# EasyEDA Pro project ProPrj_四串锂电池电源_2025-05-06.epro, board PCB2
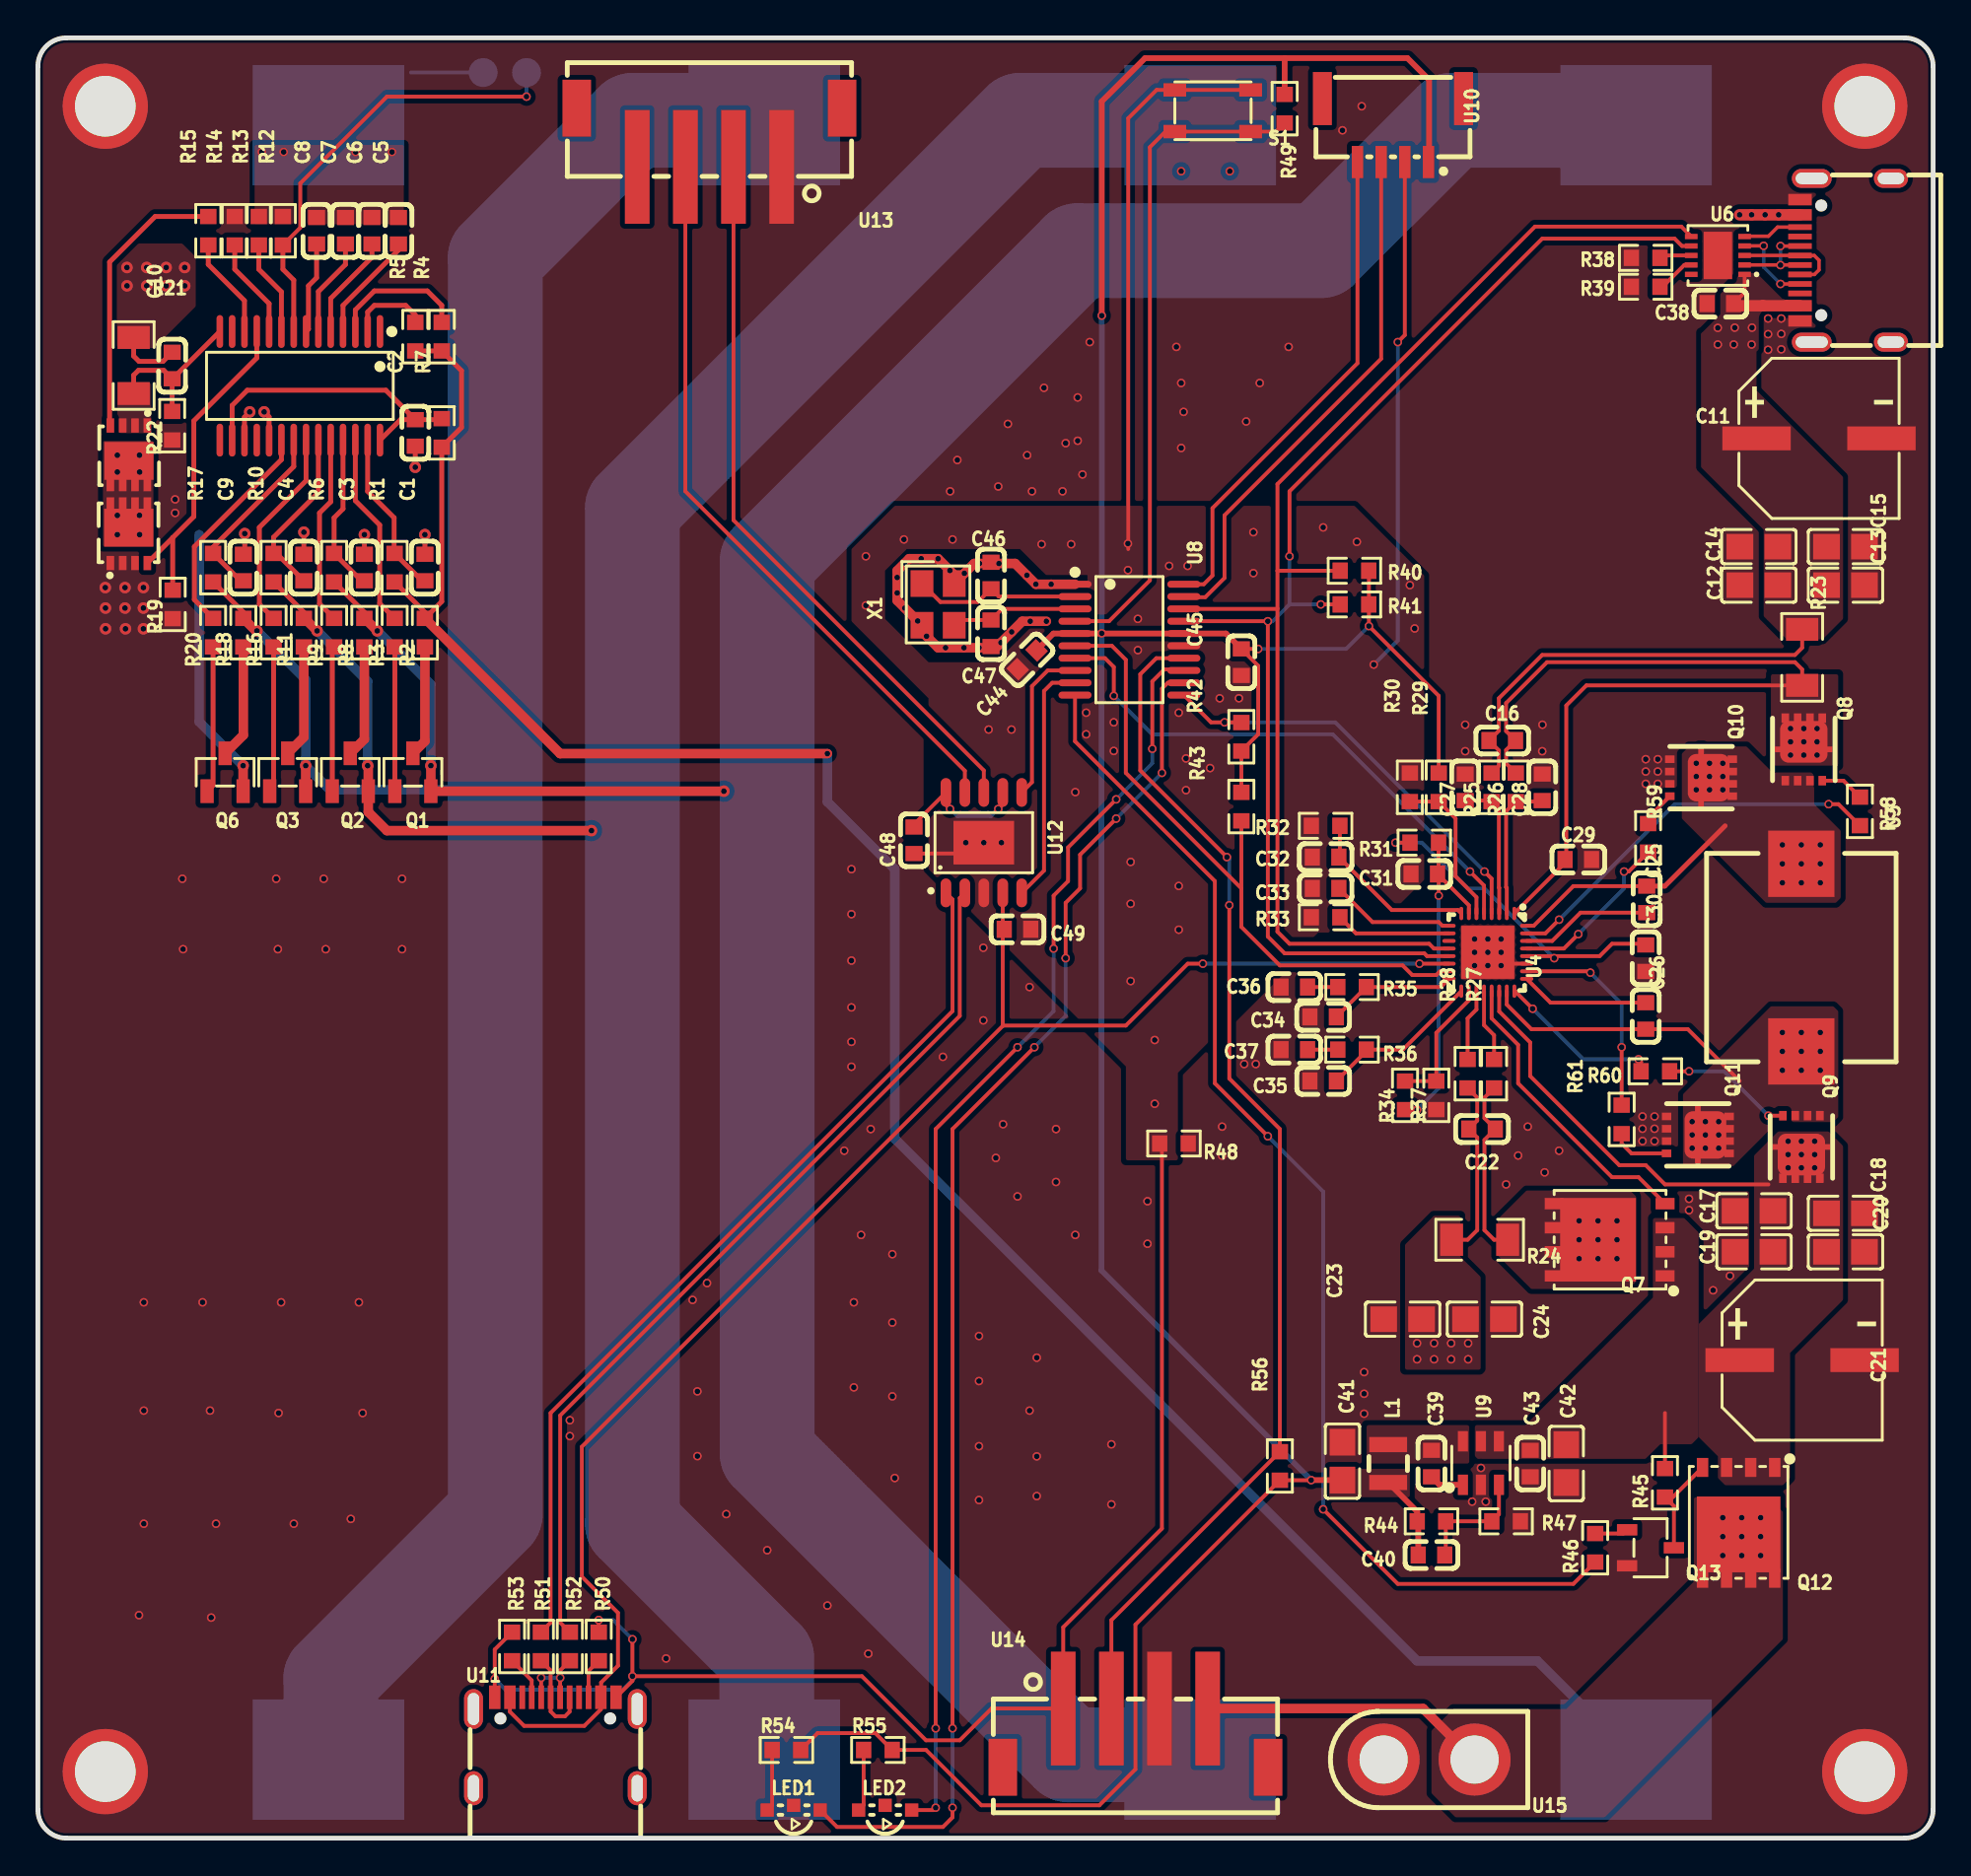
[diagram p7: board, top side]
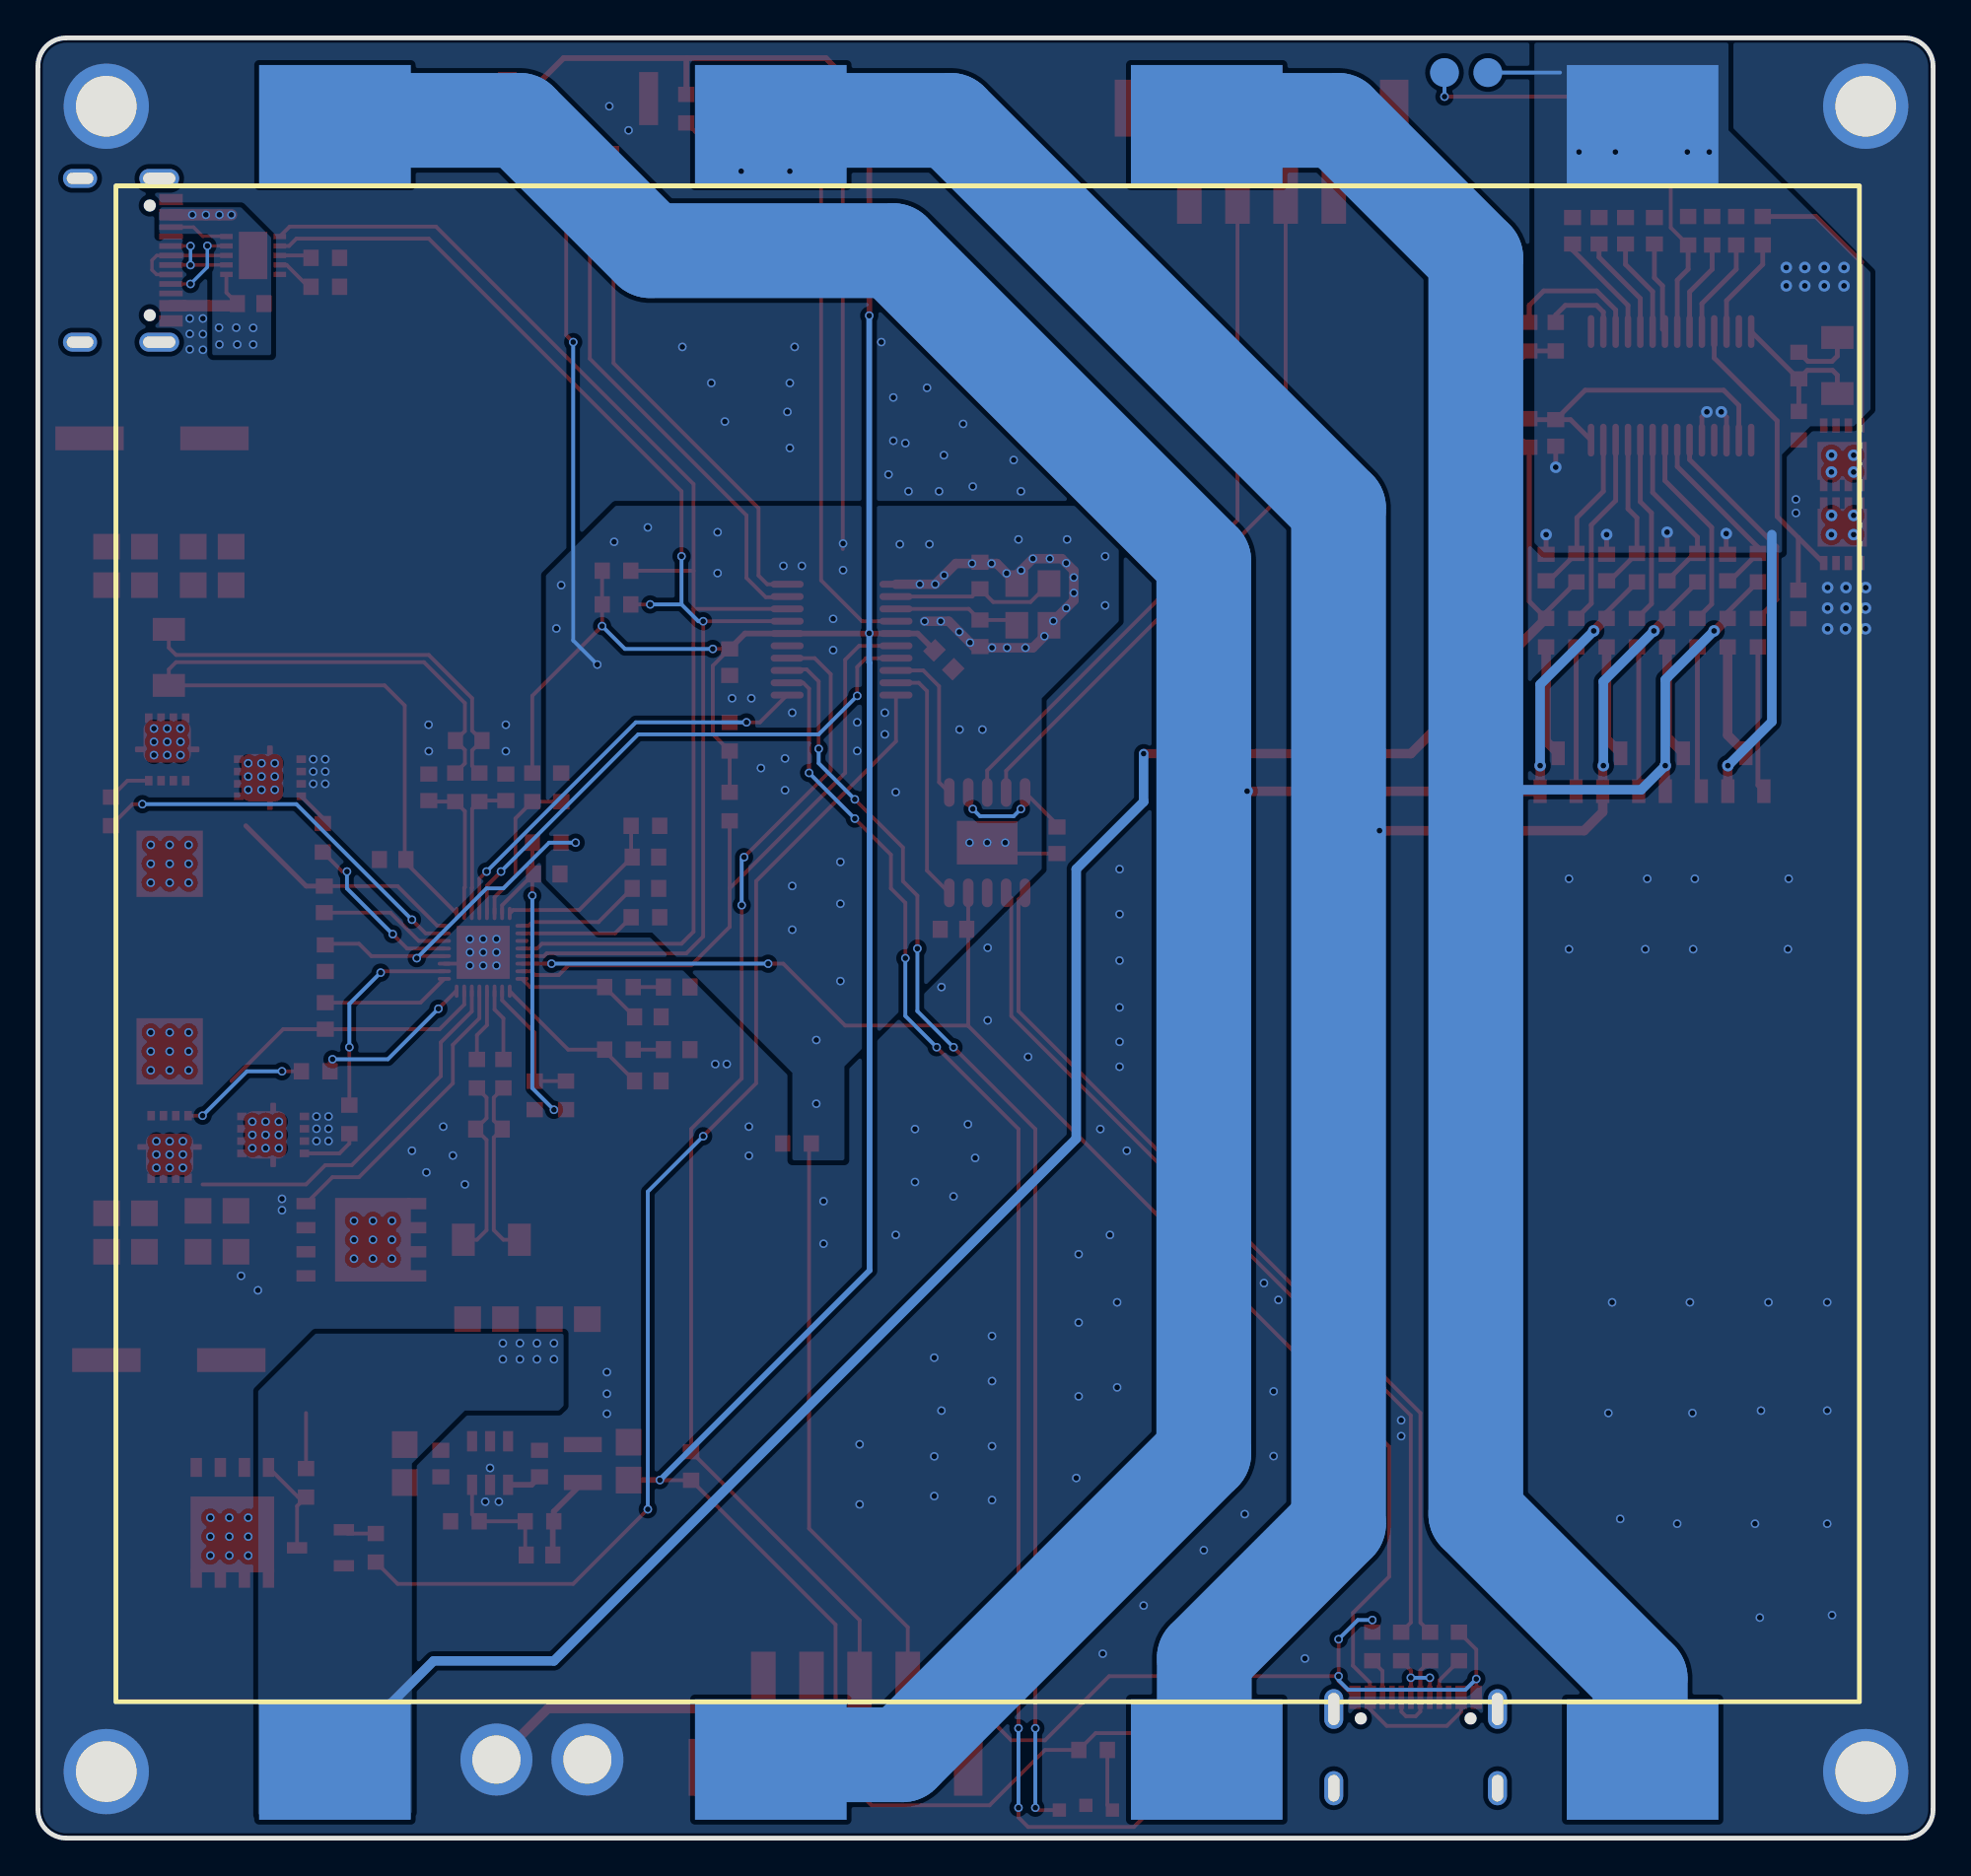
[diagram p8: board, bottom side, seen from below]

Outline 100 x 95 mm; copper layers: Top Layer, Bottom Layer. Coordinates in mm from the lower left corner of the outline.
Outline path: 0,93.5 0,1.5 arc(0.44,0.44) 1.5,0 98.5,0 arc(99.56,0.44) 100,1.5 100,93.5 arc(99.56,94.56) 98.5,95 1.5,95 arc(0.44,94.56) 0,93.5
Stack: Top Layer 0.035mm / Dielectric1 1.51mm FR4 er 4.5 / Bottom Layer 0.035mm

## Design rules (mm)
template: 自定义配置
spacing copperThickness1oz (default): track to track 0.102, other pairs 0.152 to 0.3
spacing copperThickness2oz: track to track 0.203, other pairs 0.152 to 0.3
track width copperThickness1oz (default): min 0.127, default 0.254, max 5
track width copperThickness2oz: min 0.203, default 0.254, max 2.54
differential pair differentialPair (default): width min 0.127, default 0.254, max 2.54; gap min 0.152, default 0.152
via viaSize (default): diameter min 0.45, default 0.61, max 10; hole min 0.3, default 0.305, max 6.3

## Placement (name value [footprint] x y rotation side)
C1  100nF  [C0603]  20.42 67.05 90 top
C2  10uF  [C0603]  19.91 74.15 270 top
C3  100nF  [C0603]  17.23 67.05 90 top
C4  100nF  [C0603]  14.03 67.05 90 top
C5  100nF  [C0603]  19.02 84.82 90 top
C6  100nF  [C0603]  17.63 84.82 90 top
C7  100nF  [C0603]  16.23 84.82 90 top
C8  100nF  [C0603]  14.7 84.82 90 top
C9  100nF  [C0603]  10.84 67.05 90 top
C10  10nF  [C0603]  7.08 77.71 90 top
C11  220uF  [CAP-SMD_BD8.0-L8.3-W8.3-LS9.0-FD]  93.98 73.87 0 top
C12  22uF  [C0805]  90.8 66.12 180 top
C13  22uF  [C0805]  95.38 66.12 0 top
C14  22uF  [C0805]  90.8 68.15 180 top
C15  22uF  [C0805]  95.38 68.15 0 top
C16  100nF  [C0603]  77.27 57.92 0 top
C17  22uF  [C0805]  90.55 33.1 180 top
C18  22uF  [C0805]  95.38 32.97 0 top
C19  22uF  [C0805]  90.55 30.94 180 top
C20  22uF  [C0805]  95.38 30.94 0 top
C21  220uF  [CAP-SMD_BD8.0-L8.3-W8.3-LS9.0-FD]  93.09 25.23 0 top
C22  100nF  [C0603]  76.2 37.42 180 top
C23  22uF  [C0805]  72.01 27.39 180 top
C24  22uF  [C0805]  76.33 27.39 0 top
C25  47nF  [C0603]  84.89 49.54 90 top
C26  47nF  [C0603]  84.84 43.39 90 top
C27  33nF  [C0603]  75.31 55.45 270 top
C28  33nF  [C0603]  79.38 55.45 270 top
C29  100nF  [C0603]  81.28 51.64 0 top
C30  2.2uF  [C0603]  84.84 46.44 270 top
C31  1uF  [C0603]  73.15 50.88 0 top
C32  20pF  [C0603]  67.95 51.77 0 top
C33  20pF  [C0603]  67.95 50.12 0 top
C34  NC  [C0603]  67.82 43.34 0 top
C35  NC  [C0603]  67.82 39.96 0 top
C36  220pF  [C0603]  66.29 44.91 0 top
C37  330pF  [C0603]  66.29 41.61 0 top
C38  100nF  [C0603]  88.77 80.98 0 top
C39  100nF  [C0603]  73.53 19.77 270 top
C40  100pF  [C0603]  73.53 14.94 180 top
C41  22uF  [C0805]  68.83 19.89 270 top
C42  100nF  [C0805]  80.64 19.77 90 top
C43  100nF  [C0603]  78.74 19.77 90 top
C44  100nF  [C0603]  52.2 62.18 225 top
C45  100nF  [C0603]  63.5 62.06 90 top
C46  20pF  [C0603]  50.29 66.63 270 top
C47  20pF  [C0603]  50.29 63.58 90 top
C48  100nF  [C0603]  46.23 52.66 90 top
C49  100nF  [C0603]  51.69 47.96 0 top
L1  4.7uH  [IND-SMD_L2.5-W2.0_FWP252012P-2R2ML]  71.25 19.77 270 top
LED1  MHS110WDT-C3  [LED-SMD_L3.0-W1.5_MHS110WDT-C1]  39.88 1.6 180 top
LED2  MHS110WDT-C3  [LED-SMD_L3.0-W1.5_MHS110WDT-C1]  44.7 1.6 180 top
NOREF  -  [Pad_e167]  3.56 91.39 0 top
NOREF#2  -  [Pad_e166]  3.56 3.51 0 top
NOREF#3  -  [Pad_e1010]  25.78 93.17 0 top
NOREF#4  -  [Pad_e1014]  23.5 93.17 0 top
NOREF#5  -  [Pad_e121]  96.39 3.51 0 top
NOREF#6  -  [Pad_e168]  96.39 91.39 0 top
Q1  2N7002K  [SOT-23-3_L2.9-W1.3-P1.90-LS2.4-BL-1]  19.78 56.25 0 top
Q2  2N7002K  [SOT-23-3_L2.9-W1.3-P1.90-LS2.4-BL-1]  16.48 56.25 0 top
Q3  2N7002K  [SOT-23-3_L2.9-W1.3-P1.90-LS2.4-BL-1]  13.18 56.25 0 top
Q4  RU3030M2  [PDFN3333-8_L3.1-W3.2-P0.65-LS3.4-BL]  4.8 68.82 0 top
Q5  RU3030M2  [PDFN3333-8_L3.1-W3.2-P0.65-LS3.4-BL]  4.8 73.01 180 top
Q6  2N7002K  [SOT-23-3_L2.9-W1.3-P1.90-LS2.4-BL-1]  9.88 56.25 0 top
Q7  HY12P03C2  [DFN-8_L5.9-W5.2-P1.27-LS6.2-BL]  82.93 31.58 90 top
Q8  TPN2R703NL  [TSON3x3]  93.18 57.45 0 top
Q9  TPN2R703NL  [TSON3x3]  93.05 36.47 180 top
Q10  TPN2R703NL  [TSON3x3]  87.76 55.96 270 top
Q11  TPN2R703NL  [TSON3x3]  87.59 37.11 270 top
Q12  HY12P03C2  [DFN-8_L5.9-W5.2-P1.27-LS6.2-BL]  89.74 16.64 180 top
Q13  S8050  [SOT-23-3_L2.9-W1.6-P1.90-LS2.8-BR]  85.09 15.32 180 top
R1  470Ω  [R0603]  18.82 67.04 270 top
R2  100Ω  [R0603]  20.42 63.61 90 top
R3  1MΩ  [R0603]  18.82 63.61 270 top
R4  1MΩ  [R0603]  21.31 79.23 270 top
R5  1MΩ  [R0603]  19.91 79.23 270 top
R6  470Ω  [R0603]  15.63 67.04 270 top
R7  470Ω  [R0603]  21.31 74.15 270 top
R8  100Ω  [R0603]  17.23 63.61 90 top
R9  1MΩ  [R0603]  15.63 63.61 270 top
R10  470Ω  [R0603]  12.44 67.04 270 top
R11  100Ω  [R0603]  14.03 63.61 90 top
R12  SDNT1608X103F3380FTF  [R0603]  12.93 84.82 270 top
R13  6.98kΩ  [R0603]  11.66 84.82 270 top
R14  47kΩ  [R0603]  10.39 84.82 270 top
R15  470Ω  [R0603]  8.99 84.82 270 top
R16  1MΩ  [R0603]  12.44 63.61 270 top
R17  470Ω  [R0603]  9.24 67.04 270 top
R18  100Ω  [R0603]  10.84 63.61 90 top
R19  10MΩ  [R0603]  7.11 65.1 90 top
R20  1MΩ  [R0603]  9.24 63.61 270 top
R21  5mΩ  [R1206]  5.05 77.71 90 top
R22  10MΩ  [R0603]  7.08 74.54 90 top
R23  10m  [R1206]  93.09 62.31 270 top
R24  10m  [R1206]  76.07 31.58 180 top
R25  5R1  [R0603]  76.71 55.45 90 top
R26  5R1  [R0603]  77.98 55.45 90 top
R27  10R  [R0603]  76.83 40.34 270 top
R28  10R  [R0603]  75.44 40.34 270 top
R29  1K  [R0603]  73.91 55.45 90 top
R30  10K  [R0603]  72.39 55.45 270 top
R31  10R  [R0603]  73.15 52.53 180 top
R32  169K  [R0603]  67.95 53.42 0 top
R33  30K  [R0603]  67.95 48.59 0 top
R34  3.3K  [R0603]  72.14 39.2 270 top
R35  68K  [R0603]  69.34 44.91 0 top
R36  27K  [R0603]  69.34 41.61 0 top
R37  10K  [R0603]  73.79 39.2 90 top
R38  NC  [R0603]  84.84 83.39 0 top
R39  NC  [R0603]  84.84 81.87 0 top
R40  4.7K  [R0603]  69.47 66.88 0 top
R41  4.7K  [R0603]  69.47 65.1 0 top
R42  4.7K  [R0603]  63.5 58.12 270 top
R43  4.7K  [R0603]  63.5 54.44 90 top
R44  45.3K  [R0603]  73.53 16.72 180 top
R45  100kΩ  [R0603]  85.85 18.75 90 top
R46  10kΩ  [R0603]  82.17 15.32 90 top
R47  10K  [R0603]  77.47 16.72 180 top
R48  0  [R0603]  59.94 36.66 180 top
R49  10K  [R0603]  65.79 91.27 90 top
R50  5.1K  [R0603]  29.59 10.11 90 top
R51  22R  [R0603]  26.54 10.11 90 top
R52  22R  [R0603]  28.07 10.11 90 top
R53  5.1K  [R0603]  25.02 10.11 90 top
R54  10K  [R0603]  39.5 4.65 0 top
R55  10K  [R0603]  44.32 4.65 0 top
R56  10K  [R0603]  65.53 19.64 270 top
R58  3R3  [R0603]  96.14 54.18 90 top
R59  3R3  [R0603]  84.96 52.78 90 top
R60  3R3  [R0603]  85.34 40.47 180 top
R61  3R3  [R0603]  83.57 37.93 90 top
S1  Button  [PTS810-3*4-CurvePin]  61.99 91.15 180 top
U1  BM3451UNDC-T28A  [TSSOP-28_L9.7-W4.4-P0.65-LS6.4-BL]  13.82 76.64 180 top
U2  -  [21700四节电池仓]  84.33 4.14 90 bottom
U3  4.7uH  [IND-SMD_L11.0-W10.0]  93.05 46.47 270 top
U4  SC8886SQDER  [QFN-32_L4.0-W4.0-P0.40-BL-EP2.8]  76.51 46.74 180 top
U5  GT-USB-7010ASV  [USB-C-SMD_G-SWITCH_GT-USB-7010ASV]  95.38 83.27 90 top
U6  HUSB238_002DD  [DFN-10_L3.0-W3.0-P0.50-BL-EP2.5]  88.65 83.52 90 top
U8  STM32F030F4P6  [TSSOP-20_L6.5-W4.4-P0.65-LS6.4-BL]  57.59 63.24 270 top
U9  RY9121E  [SOT-23-6_L2.9-W1.6-P0.95-LS2.8-BL]  76.14 19.79 0 top
U10  WAFER-GH1.25-4PLB  [CONN-SMD_4P-P1.25_XUNPU_WAFER-GH1.25-4PLB]  71.5 90.12 180 top
U11  GT-USB-7010ASV  [USB-C-SMD_G-SWITCH_GT-USB-7010ASV]  27.31 5.03 0 top
U12  CH342K  [SSOP-10_L5.0-W3.9-P1.00-LS6.0-BL-EP]  49.91 52.53 0 top
U13  ZX-XH2.54-4PLT  [CONN-SMD_4P-P2.54_C9900012758]  35.43 89.74 180 top
U14  ZX-XH2.54-4PLT  [CONN-SMD_4P-P2.54_C9900012758]  57.91 5.29 0 top
U15  XT30U-F  [CONN-TH_XT30U-F]  73.41 4.14 180 top
X1  8MHz  [CRYSTAL-SMD_4P-L3.2-W2.5-BL]  47.5 65.1 270 top

## Footprints (pads in the part's own frame, mm; a bottom-side part is the same pattern mirrored in y, then rotated)
21700四节电池仓
  rect 6.35x8 smd: 1(0,0) 2(86.25,0) 3(0,-23) 4(86.25,-23) 5(0,-46) 6(86.25,-46) 7(0,-69) 8(86.25,-69)
C0603
  rect 0.8x0.9 smd: 1(-0.7,0) 2(0.7,0)
C0805
  rect 1.41x1.35 smd: 1(-1,0) 2(1,0)
CAP-SMD_BD8.0-L8.3-W8.3-LS9.0-FD
  rect 3.61x1.26 smd: 1(-3.295,0) 2(3.295,0)
CONN-SMD_4P-P1.25_XUNPU_WAFER-GH1.25-4PLB
  rect 0.6x1.7 smd: 1(-1.875,1.675) 2(-0.625,1.675) 3(0.625,1.675) 4(1.875,1.675)
  rect 1x2.8 smd: 5(-3.725,-1.675) 6(3.725,-1.675)
CONN-SMD_4P-P2.54_C9900012758
  rect 1.3x6 smd: 1(-3.811,1.55) 2(-1.27,1.55) 3(1.27,1.55) 4(3.81,1.55)
  rect 1.5x3 smd: 5(7,-1.55) 6(-7,-1.55)
CONN-TH_XT30U-F
  round 3.8 hole 2.54: 1(2.4,0) 2(-2.4,0)
CRYSTAL-SMD_4P-L3.2-W2.5-BL
  rect 1.4x1.2 smd: 1(-1.1,-0.85) 2(1.1,-0.85) 3(1.1,0.85) 4(-1.1,0.85)
DFN-8_L5.9-W5.2-P1.27-LS6.2-BL
  rect 0.6x1 smd: 1(-1.905,-2.925) 2(-0.635,-2.925) 3(0.635,-2.925) 4(1.905,-2.925) 5(1.905,2.925) 6(0.635,2.925) 7(-0.635,2.925) 8(-1.905,2.925)
  rect 4.41x4 smd: 9(0,0.61)
DFN-10_L3.0-W3.0-P0.50-BL-EP2.5
  rect 0.28x0.665 smd: 1(-1,-1.407) 2(-0.5,-1.407) 3(0,-1.407) 4(0.5,-1.407) 5(1,-1.407) 6(1,1.407) 7(0.5,1.407) 8(0,1.407) 9(-0.5,1.407) 10(-1,1.407)
  rect 2.5x1.5 smd: 11(0,0)
IND-SMD_L2.5-W2.0_FWP252012P-2R2ML
  rect 0.8x2 smd: 1(-1,0) 2(1,0)
IND-SMD_L11.0-W10.0
  rect 3.5x3.5 smd: 1(-4.95,0) 2(4.95,0)
LED-SMD_L3.0-W1.5_MHS110WDT-C1
  rect 0.7x0.7 smd: 1(1.4,0.125) 2(-1.4,0.125) 3(0,-0.125)
Pad_e121
  round 4.5 hole 3.2: 1(0,0)
Pad_e166
  round 4.5 hole 3.2: 1(0,0)
Pad_e167
  round 4.5 hole 3.2: 1(0,0)
Pad_e168
  round 4.5 hole 3.2: 1(0,0)
Pad_e1010
  round 1.524 smd far side: 1(0,0)
Pad_e1014
  round 1.524 smd far side: 1(0,0)
PDFN3333-8_L3.1-W3.2-P0.65-LS3.4-BL
  rect 0.4x0.75 smd: 1(-0.975,-1.534) 2(-0.325,-1.534) 3(0.325,-1.534) 4(0.975,-1.534)
  rect 0.4x0.8 smd: 5(0.975,1.534) 6(0.325,1.534) 7(-0.325,1.534) 8(-0.975,1.534)
  rect 2.6x2 smd: 9(-0.004,0.333)
PTS810-3*4-CurvePin
  rect 1.2x0.7 smd: 1(-2,-1.1) 1(2,-1.1) 2(-2,1.1) 2(2,1.1)
QFN-32_L4.0-W4.0-P0.40-BL-EP2.8
  oval 0.2x0.7 smd: 1(-1.4,-2.05) 2(-1,-2.05) 3(-0.6,-2.05) 4(-0.2,-2.05) 5(0.2,-2.05) 6(0.6,-2.05) 7(1,-2.05) 8(1.4,-2.05) 17(1.4,2.05) 18(1,2.05) 19(0.6,2.05) 20(0.2,2.05) 21(-0.2,2.05) 22(-0.6,2.05) 23(-1,2.05) 24(-1.4,2.05)
  oval 0.7x0.2 smd: 9(2.05,-1.4) 10(2.05,-1) 11(2.05,-0.6) 12(2.05,-0.2) 13(2.05,0.2) 14(2.05,0.6) 15(2.05,1) 16(2.05,1.4) 25(-2.05,1.4) 26(-2.05,1) 27(-2.05,0.6) 28(-2.05,0.2) 29(-2.05,-0.2) 30(-2.05,-0.6) 31(-2.05,-1) 32(-2.05,-1.4)
  rect 2.8x2.8 smd: 33(0,0)
R0603
  rect 0.806x0.864 smd: 1(-0.753,0) 2(0.753,0)
R1206
  rect 1.208x1.701 smd: 1(-1.479,0) 2(1.479,0)
SOT-23-3_L2.9-W1.3-P1.90-LS2.4-BL-1
  rect 0.7x1.25 smd: 1(-0.95,-1) 2(0.95,-1) 3(0,1)
SOT-23-3_L2.9-W1.6-P1.90-LS2.8-BR
  rect 1.07x0.6 smd: 1(1.235,-0.95) 2(1.235,0.95) 3(-1.235,0)
SOT-23-6_L2.9-W1.6-P0.95-LS2.8-BL
  rect 0.532x1.072 smd: 1(-0.95,-1.149) 2(0,-1.149) 3(0.95,-1.149) 4(0.95,1.149) 5(0,1.149) 6(-0.95,1.149)
SSOP-10_L5.0-W3.9-P1.00-LS6.0-BL-EP
  oval 0.56x1.515 smd: 1(-2,-2.65) 2(-1,-2.65) 3(0,-2.65) 4(1,-2.65) 5(2,-2.65) 6(2,2.65) 7(1,2.65) 8(0,2.65) 9(-1,2.65) 10(-2,2.65)
  rect 3.2x2.3 smd: 11(0,0)
TSON3x3
  rect 0.4x0.5 smd: 1(-0.975,1.65) 1(-0.325,1.65) 1(0.325,1.65) 1(0.975,1.65) 2(0.975,-1.65) 3(-0.975,-1.65) 3(-0.325,-1.65) 3(0.325,-1.65)
  rrect 2.5x2.2 smd: 1(0,0.4)
  rrect 3.4x0.3 smd: 1(0,0)
TSSOP-20_L6.5-W4.4-P0.65-LS6.4-BL
  oval 0.364x1.742 smd: 1(-2.925,-2.871) 2(-2.275,-2.871) 3(-1.625,-2.871) 4(-0.975,-2.871) 5(-0.325,-2.871) 6(0.325,-2.871) 7(0.975,-2.871) 8(1.625,-2.871) 9(2.275,-2.871) 10(2.925,-2.871) 11(2.925,2.871) 12(2.275,2.871) 13(1.625,2.871) 14(0.975,2.871) 15(0.325,2.871) 16(-0.325,2.871) 17(-0.975,2.871) 18(-1.625,2.871) 19(-2.275,2.871) 20(-2.925,2.871)
TSSOP-28_L9.7-W4.4-P0.65-LS6.4-BL
  oval 0.343x1.732 smd: 1(-4.225,-2.866) 2(-3.575,-2.866) 3(-2.925,-2.866) 4(-2.275,-2.866) 5(-1.625,-2.866) 6(-0.975,-2.866) 7(-0.325,-2.866) 8(0.325,-2.866) 9(0.975,-2.866) 10(1.625,-2.866) 11(2.275,-2.866) 12(2.925,-2.866) 13(3.575,-2.866) 14(4.225,-2.866) 15(4.225,2.866) 16(3.575,2.866) 17(2.925,2.866) 18(2.275,2.866) 19(1.625,2.866) 20(0.975,2.866) 21(0.325,2.866) 22(-0.325,2.866) 23(-0.975,2.866) 24(-1.625,2.866) 25(-2.275,2.866) 26(-2.925,2.866) 27(-3.575,2.866) 28(-4.225,2.866)
USB-C-SMD_G-SWITCH_GT-USB-7010ASV
  oval 1x2.1 hole 0.6x1.7: 1(-4.32,1.78) 2(4.32,1.78)
  oval 1x1.8 hole 0.6x1.4: 3(4.32,-2.4) 4(-4.32,-2.4)
  rect 0.6x1.24 smd: A1B12(-3.2,2.4) A4B9(-2.4,2.4) B1A12(3.2,2.4) B4A9(2.4,2.4)
  rect 0.3x1.24 smd: A5(-1.25,2.4) A6(-0.25,2.4) A7(0.25,2.4) A8(1.25,2.4) B5(1.75,2.4) B6(0.75,2.4) B7(-0.75,2.4) B8(-1.75,2.4)

## Nets
As in the schematic, except:
GND: C11.2 C12.2 C13.2 C14.2 C15.2 C17.2 C18.2 C19.2 C20.2 C21.2 C23.2 C24.2 C27.1 C28.1 C29.2 C30.2 C34.1 C35.1 C36.1 C37.1 C38.1 C41.1 C42.1 C43.1 NOREF.1 NOREF#2.1 NOREF#5.1 NOREF#6.1 Q4.1 Q4.2 Q4.3 Q10.3 Q11.3 Q13.2 R14.1 R19.1 R22.1 R37.1 R38.1 R39.1 R47.1 R48.1 U4.27 U4.33 U5.A1B12 U5.B1A12 U6.11 U9.2 U13.1 U14.3 U15.1
B-: C1.2 C2.2 C3.2 C4.2 C5.2 C6.2 C7.2 C8.2 C9.2 C10.2 NOREF#4.1 Q6.2 R12.1 R13.1 R21.2 U1.17 U1.19 U2.8
$1N1982: NOREF#3.1 R12.2 U1.8
$2N18353: Q8.2 R58.2
$2N18407: Q10.2 R59.2
$2N18436: Q9.2 R60.1
$2N18466: Q11.2 R61.1

Pads without a net: LED1 3; LED2 3; U1 1 13 15 18; U4 11; U5 1 2 3 4 A8 B8; U6 10; U10 5 6; U11 1 2 3 4 A8 B8; U13 5 6; U14 5 6

## Via types
v1: diameter 0.61, hole 0.305, Top Layer to Bottom Layer, 41 vias
v2: diameter 0.45, hole 0.3, Top Layer to Bottom Layer, 363 vias

## Routing (per net, layer and track width the routed paths; a pad name or vN(x,y) marks a point on that pad's centre or on a via; arc(x,y) is an arc through that point)
3.3V: length 188.2
  Top Layer w0.2: R29.2 73.91,60.28 v2(70.23,63.96) 70.23,65.1 ; v2(67.18,18.89) 67.18,18.88 R56.2 57.91,11.26 57.91,3.64 56.01,1.73 49.78,1.73 46.86,4.65 R55.2 44.19,5.54 41.14,5.54 R54.2 ; R41.2 70.23,65.1 ; 70.23,65.1 70.23,66.87 R40.2 ; R43.2 R42.2 64.39,58.25 64.39,61.87 C45.2 v2(64.39,62.76)
  Top Layer w0.3: 65.77,93.93 72.26,93.93 73.41,92.79 73.41,88.48 U10.1 ; 65.77,93.93 58.42,93.93 56.13,91.65 v2(56.13,80.34) ; 65.77,93.93 65.79,93.92 R49.2 ; 52.69,62.68 53.58,63.57 U8.5 U8.16 62.69,63.57 C45.2 ; L1.2 72.78,17.23 R44.2 72.83,16.66 C40.2 ; C41.2 v2(67.18,18.89)
  Bottom Layer w0.2: v2(64.39,62.76) 69.03,62.76 v2(70.23,63.96)
  Bottom Layer w0.3: v2(67.18,18.89) 56.11,29.96 56.11,62.02 56.13,62.04 v2(56.13,63.58) v2(56.13,80.34)
AGND: length 157.5
  Top Layer w0.2: 57.53,68.03 57.53,90.76 59.03,92.25 S1.1 S1.1 ; U11.A1B12 v2(24.11,8.4) 24.11,9.95 R53.2 ; C48.1 48.39,51.96 v2(48.96,52.53) ; v2(29.59,11.51) R50.2 ; U11.B1A12 31.37,8.3 v2(31.37,8.54) ; v2(71.76,78.95) 72.13,79.32 U10.2 ; v2(31.37,8.54) v2(31.37,10.49) ; v2(31.37,8.54) 43.48,8.54 46.86,5.16 48.64,5.16 50.32,6.84 U14.1 54.1,11.13 59.31,16.34 59.31,36.54 R48.2
  Top Layer w0.5: 48.35,66.21 48.35,66.67 v2(48.12,66.89) v2(47.5,67.52) v2(46.6,67.52) 45.97,67.52 v2(45.74,67.29) 45.34,66.88 v2(45.34,66.53) v2(45.34,65.71) 45.34,65.31 v2(45.74,64.91) v2(46.42,64.23) X1.2 46.65,63.67 v2(46.89,63.43) 47.5,62.82 v2(47.89,62.82) v2(48.86,62.82) v2(49.66,62.82) 50.23,62.82 50.29,62.88 50.61,62.88 v2(50.82,63.09) v2(51.38,63.65) 51.94,64.22 v2(52.36,64.22) v2(53.21,64.22) ; 48.35,66.21 48.35,66.2 ; 48.35,66.21 v2(48.89,66.75) 49.4,67.26 v2(49.68,67.26) v2(50.71,67.26) 51.56,67.26 v2(52.18,66.64) v2(52.66,66.17) v2(53.46,66.17) U8.1
  Bottom Layer w0.2: v2(31.37,10.49) 30.35,11.51 v2(29.59,11.51) ; 31.33,8.58 31.37,8.54 31.37,8.34 30.86,7.83 24.68,7.83 v2(24.11,8.4) ; v2(70.48,61.93) 71.76,63.2 v2(71.76,78.95)
  vias: v2(43.69,67.64) v2(43.69,65.05) v2(45.7,68.53) v2(48.26,68.53) v2(49.91,52.53) v2(50.17,58.5) v2(50.84,52.53) v2(51.37,58.5) v2(52.96,68.28) v2(54.52,68.28) v2(54.74,55.2) v2(55.31,59.39) v2(55.31,58.25) v2(56.77,58.88) v2(56.77,57.37) v2(57.52,68.32) v2(57.52,66.91) v2(57.66,51.52) v2(57.66,49.31) v2(57.66,45.23) v2(58.04,64.34) v2(58.04,62.69) v2(58.93,42.12) v2(58.93,38.75) v2(59.69,67.14) v2(60.2,59.39) v2(60.2,50.25) v2(60.2,47.94) v2(60.58,56.98) v2(60.58,55.3) v2(60.66,67.14) v2(61.85,56.47) v2(62.36,60.15) v2(63.37,60.15) v2(64.14,68.91) v2(64.14,66.76) v2(67.82,69.17) v2(69.6,68.41) v2(72.39,66.12) v2(72.64,63.83)
GND: length 1.4
  Top Layer w0.2: U4.27 77.31,46.14 v2(77.21,46.04)
  vias: v1(3.56,65.99) v1(3.57,64.91) v1(3.57,63.82) v1(4.6,65.99) v1(4.6,64.91) v1(4.62,63.82) v1(5.57,65.99) v1(5.57,64.91) v1(5.57,63.82) v2(5.33,11.76) v2(5.59,28.27) v2(5.59,22.56) v2(5.59,16.59) v2(7.24,70.65) v2(7.24,69.93) v2(7.62,50.63) v2(7.66,46.91) v2(8.69,28.27) v2(9.08,22.56) v2(9.14,11.64) v2(9.4,16.59) v2(12.57,50.63) v2(12.66,46.91) v2(12.7,22.43) v2(12.83,28.27) v2(13.5,16.59) v2(15.08,50.63) v2(15.19,46.91) v2(16.51,16.84) v2(16.94,28.27) v2(17.13,22.43) v2(19.21,50.63) v2(19.21,46.91) v2(28.07,22.05) v2(28.07,21.21) v2(33.15,9.48) v2(34.54,28.4) v2(34.8,23.58) v2(34.8,20.16) v2(35.31,29.29) v2(36.32,17.1) v2(38.48,15.19) v2(41.66,12.27) v2(42.55,36.28) v2(42.93,51.13) v2(42.93,48.76) v2(42.93,46.31) v2(42.93,43.84) v2(42.93,42.02) v2(42.93,40.71) v2(43.05,28.27) v2(43.05,23.79) v2(43.43,31.83) v2(43.82,9.73) v2(43.94,37.42) v2(45.08,30.81) v2(45.08,27.21) v2(45.08,23.31) v2(45.21,19) v2(47.75,41.23) v2(48.13,71.07) v2(48.51,72.72) v2(49.66,26.5) v2(49.66,24.12) v2(49.66,20.68) v2(49.66,17.84) v2(49.89,46.98) v2(49.89,43.15) v2(50.55,35.89) v2(50.67,71.33) v2(50.93,37.67) v2(51.18,74.63) v2(51.69,33.86) v2(52.2,72.98) v2(52.32,44.91) v2(52.32,22.56) v2(52.45,71.07) v2(52.7,25.35) v2(52.7,20.15) v2(52.7,18.05) v2(53.09,76.53) v2(53.72,37.42) v2(53.72,34.62) v2(54.06,71.07) v2(54.23,73.61) v2(54.74,31.83) v2(54.86,76.03) v2(54.86,73.74) v2(55.12,71.96) v2(55.5,78.95) v2(56.64,20.78) v2(56.64,17.61) v2(58.55,33.61) v2(58.55,31.36) v2(60.07,78.69) v2(60.33,76.79) v2(60.33,73.36) v2(60.45,75.26) v2(62.48,37.55) v2(62.48,36.01) v2(63.65,40.85) v2(63.75,74.76) v2(64.26,40.85) v2(64.47,76.79) v2(66,78.69) v2(68.83,90.12) v2(69.85,91.39) v2(69.98,24.59) v2(69.98,23.45) v2(69.98,22.39) v2(75.31,58.75) v2(75.31,57.36) v2(75.68,17.76) v2(75.81,47.44) v2(75.81,46.74) v2(75.81,46.04) v2(76.14,19.53) v2(76.39,17.75) v2(76.51,47.44) v2(76.51,46.74) v2(76.51,46.04) v2(77.21,47.44) v2(77.21,46.74) v2(77.47,34.5) v2(78.11,36.02) v2(78.61,37.55) v2(79.39,58.75) v2(79.38,57.36) v2(79.5,35.13) v2(80.26,36.28) v2(84.67,38.08) v2(84.67,37.43) v2(84.67,36.78) v2(84.84,56.94) v2(84.84,56.28) v2(84.84,55.64) v2(85.3,38.08) v2(85.3,37.43) v2(85.3,36.78) v2(85.47,56.94) v2(85.47,56.28) v2(85.47,55.64) v2(87.12,33.73) v2(87.12,33.14) v2(88.39,28.91) v2(89.28,29.67) v2(91.29,80.19) v2(91.29,79.37) v2(91.29,78.54) v2(91.99,80.19) v2(91.99,79.38) v2(91.99,78.57)
VBUS: length 31.1
  Top Layer w0.2: C38.2 90.05,81.56 U6.1 ; R25.2 77.09,56.59 77.09,57.4 C16.1 77.09,58.44 77.09,60.15 79.38,62.44 92.71,62.44 93.09,62.82 R23.1
  Top Layer w0.6: U5.B4A9 v2(91.85,85.67) v2(91.14,85.67) v2(90.42,85.67) v2(89.79,85.67) ; U5.A4B9 92.27,80.87 92.27,80.87 91.01,80.87 91.01,80.87 89.59,80.87 C38.2
  vias: v2(88.64,79.7) v2(88.64,78.82) v2(89.48,78.82) v2(89.54,79.71) v2(90.44,79.71) v2(90.42,78.82)
VDDA: length 17.9
  Top Layer w0.2: v2(72.77,38.43) 72.14,38.43 R34.2 ; 73.91,50.82 73.85,50.88 73.91,50.93 R31.1 ; 73.91,50.82 75.51,49.23 U4.7 ; 73.91,50.82 v2(73.91,49.74)
  Bottom Layer w0.2: v2(72.77,38.43) 73.91,39.58 v2(73.91,49.74)
VIN: length 8.5
  Top Layer w0.254: R22.2 7.08,76.99 U1.14 ; 5.05,76.23 5.05,77.2 5.31,77.46 6.64,77.46 C10.1
B-: length 30.3
  Top Layer w0.254: C10.2 6.6,77.93 5.33,77.93 5.05,78.21 R21.2 ; C2.2 v1(19.91,72.34) ; C4.2 v1(14.03,68.91) ; U1.19 12.2,75 v1(11.94,75.26) ; U1.17 10.9,74.99 v1(11.18,75.26) ; C3.2 v1(17.23,68.79) ; v1(10.91,68.84) 10.91,67.82 C9.2 ; C1.2 v1(20.42,68.79)
  Top Layer w0.5: Q6.2 v1(10.83,56.59)
  Bottom Layer w0.2: NOREF#4.1 19.69,93.17
  Bottom Layer w0.5: v1(10.83,56.59) 8.51,58.91 8.51,68.79
  vias: v1(4.7,82.88) v1(4.7,81.92) v1(5.74,82.88) v1(5.74,81.92) v1(6.77,82.88) v1(6.77,81.92) v1(7.75,82.88) v1(7.75,81.92) v2(11.81,88.98) v2(12.97,88.98) v2(16.76,88.98) v2(18.68,88.98)
BAT1: length 121.4
  Top Layer w0.254: R18.2 10.84,64.69 R17.2
  Top Layer w0.5: R18.2 11.5,63.71 v1(11.56,63.71) ; Q3.2 v1(14.13,56.59)
  Bottom Layer w0.5: v1(11.56,63.71) 14.13,61.13 v1(14.13,56.59) 15.4,55.33 21.97,55.33
  Bottom Layer w5: 38.45,90.65 31.39,90.65 24.13,83.39 24.13,17.1 15.45,8.42 15.45,4.4
BAT2: length 133.7
  Top Layer w0.254: R11.2 14.03,64.69 R10.2
  Top Layer w0.5: v1(29.21,53.17) 18.42,53.17 17.43,54.15 Q2.2 17.43,56.56 v1(17.4,56.59) ; v1(14.73,63.71) 14.07,64.37 R11.2
  Bottom Layer w0.5: v1(14.73,63.71) 17.4,61.04 v1(17.4,56.59)
  Bottom Layer w5: 38.45,4.4 38.45,9.5 31.37,16.59 31.37,70.18 51.83,90.65 61.45,90.65
  vias: v2(60.33,87.96) v2(62.89,87.96)
BAT3: length 160.9
  Top Layer w0.254: R6.2 17.23,64.69 R8.2
  Top Layer w0.5: R8.2 17.25,64.37 v1(17.91,63.71) ; v1(20.73,56.59) Q1.2 v1(36.2,55.25)
  Bottom Layer w0.5: v1(20.73,56.59) 20.73,60.88 v1(17.91,63.71)
  Bottom Layer w5: 61.45,4.4 54.38,4.4 38.48,20.3 38.48,67.39 54.86,83.77 67.69,83.77 74.57,90.65 84.45,90.65
BAT4: length 127.6
  Top Layer w0.2: R24.2 75.44,31.58 75.95,32.08 75.95,36.97 C22.2 75.95,37.86 75.95,39.08 R28.2
  Top Layer w0.254: R1.2 20.42,64.69 R2.2 21.31,65.26 R7.2 22.35,74.45 22.35,77.44 R4.2 R5.2
  Top Layer w0.5: v2(41.66,57.23) 27.56,57.23 R2.2
  Bottom Layer w0.5: U2.1 79.12,9.35 72.77,9.35 45.21,36.91 45.21,51.13 41.66,54.69 v2(41.66,57.23)
  vias: v2(72.77,26.12) v2(72.77,25.27) v2(73.67,26.12) v2(73.67,25.27) v2(74.57,26.12) v2(74.57,25.27) v2(75.47,26.12) v2(75.47,25.27)
BT1: length 7
  Top Layer w0.2: C25.1 81.4,48.84 79.9,47.34 U4.30
BT2: length 6.8
  Top Layer w0.2: C26.2 79.81,44.09 U4.25
CC1: length 4.4
  Top Layer w0.18: v2(91.06,84.03) 90.06,84.03 U6.4 ; U5.A5 v2(91.95,82.02)
  Bottom Layer w0.18: v2(91.06,84.03) 91.06,82.9 v2(91.95,82.02)
CC2: length 3.1
  Top Layer w0.18: U5.B5 91.79,85.02 91.31,84.53 90.07,84.53 U6.5
CHRG_OK: length 23
  Top Layer w0.2: R42.1 63.49,58.88 v2(62.61,58.88) 61.9,58.88 60.47,60.32 ; v2(76.33,51.01) 76.71,50.63 U4.4
  Bottom Layer w0.2: v2(62.61,58.88) 68.45,58.88 v2(76.33,51.01)
CMPIN: length 84.6
  Top Layer w0.2: U11.A4B9 24.91,6.67 25.65,5.92 28.83,5.92 29.7,6.8 U11.B4A9 29.72,7.45 29.72,8.21 30.61,9.1 30.61,9.11 30.61,11.89 28.7,13.8 28.7,20.65 50.91,42.86 ; 50.91,42.86 U12.4 ; 50.91,42.86 50.93,42.88 57.4,42.88 60.67,46.14 v2(61.47,46.14) ; U4.14 v2(72.9,46.14)
  Bottom Layer w0.2: v2(72.9,46.14) v2(61.47,46.14)
CMPOUT: length 35.3
  Top Layer w0.2: 63.5,50.12 57.4,56.21 57.4,62.18 56.67,62.92 U8.6 ; 63.5,50.12 63.5,48.09 65.53,46.05 72.01,46.05 72.52,45.55 73.79,45.55 73.99,45.74 U4.15 ; 63.5,50.12 R43.1
D+: length 5
  Top Layer w0.18: U6.2 92.97,83.02 U5.A6 ; U5.B6 v2(91.95,84.02)
  Bottom Layer w0.18: v2(91.95,84.02) v2(91.95,83.01)
D-: length 5.6
  Top Layer w0.18: U5.B7 93.74,82.52 93.98,82.76 93.98,83.27 93.73,83.52 U5.A7 92.97,83.52 U6.3
HD1: length 20.9
  Top Layer w0.2: v2(94.49,54.56) 95,54.56 R58.1 ; U4.31 79.54,47.74 v2(80.26,48.47)
  Bottom Layer w0.2: v2(80.26,48.47) 86.36,54.56 v2(94.49,54.56)
HD2: length 8.7
  Top Layer w0.2: U4.24 77.94,44.69 v2(78.87,43.77) ; R60.2 84.59,40.97 v2(84.45,41.1)
  Bottom Layer w0.2: v2(84.45,41.1) 81.53,41.1 v2(78.87,43.77)
ILIM_HIZ: length 8.3
  Top Layer w0.2: R30.2 R29.1 74.8,53.81 74.8,50.75 75.91,49.65 U4.6
KEY: length 64
  Top Layer w0.2: v2(62.74,51.77) 58.17,56.34 58.17,61.42 59.01,62.27 U8.14 ; U14.2 56.64,11.5 R56.1 65.53,37.42 62.86,40.09 v2(62.86,49.23)
  Bottom Layer w0.2: v2(62.74,51.77) 62.86,51.64 v2(62.86,49.23)
LD1: length 9
  Top Layer w0.2: R59.1 83.94,51.01 v2(83.69,51.01) ; v2(81.28,47.7) 80.52,46.94 U4.29
  Bottom Layer w0.2: v2(81.28,47.7) 83.69,50.12 v2(83.69,51.01)
LD2: length 11.1
  Top Layer w0.2: R61.2 v2(83.57,41.74) ; U4.26 81.84,45.74 v2(81.92,45.67)
  Bottom Layer w0.2: v2(83.57,41.74) 83.57,44.02 v2(81.92,45.67)
LED1: length 73
  Top Layer w0.2: LED1.2 42.17,0.59 47.75,0.59 48.26,1.1 v2(48.26,1.6) ; U8.12 59.62,60.97 59.31,60.66 v2(59.31,56.21) ; v2(48.26,5.8) 48.26,37.42 v2(52.58,41.74) ; v2(56.9,53.8) 54.99,51.9 54.99,50.12 54.23,49.36 v2(54.23,46.44)
  Bottom Layer w0.2: v2(54.23,46.44) 54.23,43.39 v2(52.58,41.74) ; v2(59.31,56.21) v2(56.9,53.8) ; v2(48.26,1.6) v2(48.26,5.8)
LED2: length 67.4
  Top Layer w0.2: v2(47.37,1.6) 47.25,1.48 LED2.2 ; U8.13 60.41,61.67 59.44,61.67 58.8,61.04 v2(58.8,57.48) ; v2(53.59,46.94) 53.59,49.74 54.36,50.5 54.36,52.28 v2(56.9,54.82) ; v2(51.69,41.74) 47.37,37.42 v2(47.37,5.8)
  Bottom Layer w0.2: v2(58.8,57.48) 58.8,56.72 v2(56.9,54.82) ; v2(51.69,41.74) 53.59,43.64 v2(53.59,46.94) ; v2(47.37,1.6) v2(47.37,5.8)
OSCIN: length 8.9
  Top Layer w0.2: 46.65,66.2 47.62,65.23 49.6,65.23 C46.2 50.7,65.52 54.72,65.52
OSCOUT: length 6.7
  Top Layer w0.2: U8.3 50.88,64.87 C47.2 48.62,64.28 X1.3
OTGNAP: length 28.9
  Top Layer w0.2: v2(56.77,60.28) 56.77,61.8 56.3,62.27 U8.7 ; v2(75.57,51.01) 76.31,50.27 U4.5
  Bottom Layer w0.2: v2(56.77,60.28) 58.8,58.25 68.33,58.25 v2(75.57,51.01)
PA4: length 64.8
  Top Layer w0.2: R46.1 81.02,13.41 71.76,13.41 v2(67.82,17.35) ; v2(64.9,37.04) 62.1,39.83 62.1,50.5 54.72,57.88 54.72,60.32
  Bottom Layer w0.2: v2(67.82,17.35) 67.82,34.12 v2(64.9,37.04)
RST: length 35.3
  Top Layer w0.2: R49.1 65.33,90.05 S1.2 S1.2 59.49,90.05 58.67,89.23 58.67,66.37 56.52,64.22 U8.4
RX1: length 39.1
  Top Layer w0.2: U12.9 48.91,56.33 34.16,71.07 U13.3
RX2: length 8.4
  Top Layer w0.2: U8.8 53.28,61.62 52.45,60.79 52.45,55.72 U12.6
SCL: length 68.1
  Top Layer w0.2: v2(66.04,67.64) 66.04,71.07 79.38,84.41 86.36,84.41 86.75,84.02 U6.7 ; U8.17 64.89,64.22 v2(64.9,64.22) 64.9,47.58 65.79,46.69 73.15,46.69 73.3,46.54 U4.13 ; v2(67.69,65.1) R41.1
  Bottom Layer w0.2: 66.04,65.1 v2(67.69,65.1) ; 66.04,65.1 v2(66.04,67.64) ; 66.04,65.1 65.15,64.22 v2(64.9,64.22)
SDA: length 69
  Top Layer w0.2: 65.41,66.87 65.41,66.88 R40.1 ; 65.41,66.87 65.41,64.89 ; 65.41,66.87 65.41,71.45 78.99,85.04 86.71,85.04 U6.6 ; U8.18 65.39,64.87 65.41,64.89 ; 65.41,64.89 65.41,47.83 66.04,47.2 73.41,47.2 73.66,46.94 U4.12
SW1: length 12.7
  Top Layer w0.2: U4.32 78.93,48.14 81.02,50.24 C25.2
  Top Layer w0.254: C25.2 85.85,50.24 89.03,53.42
  vias: v2(87.5,56.72) v2(87.5,56.02) v2(87.5,55.32) v2(88.2,56.72) v2(88.2,56.02) v2(88.2,55.32) v2(88.9,56.72) v2(88.9,56.02) v2(88.9,55.32) v2(92.05,52.42) v2(92.05,51.42) v2(92.05,50.42) v2(93.05,52.42) v2(93.05,51.42) v2(93.05,50.42) v2(94.05,52.42) v2(94.05,51.42) v2(94.05,50.42)
SW2: length 14.7
  Top Layer w0.2: U4.23 77.51,43.99 78.8,42.69 C26.1 87.06,42.69 89.79,39.96
  vias: v2(87.29,37.81) v2(87.29,37.11) v2(87.29,36.41) v2(87.99,37.81) v2(87.99,37.11) v2(87.99,36.41) v2(88.69,37.81) v2(88.69,37.11) v2(88.69,36.41) v2(92.05,42.52) v2(92.05,41.52) v2(92.05,40.52) v2(93.05,42.52) v2(93.05,41.52) v2(93.05,40.52) v2(94.05,42.52) v2(94.05,41.52) v2(94.05,40.52)
SWCLK: length 26.7
  Top Layer w0.2: U8.20 61.52,66.17 61.98,66.63 61.98,70.18 69.63,77.83 U10.4
SWDIO: length 28
  Top Layer w0.2: U10.3 70.88,78.07 62.61,69.8 62.61,66.5 61.6,65.48 60.5,65.48 60.47,65.52
TX1: length 38.5
  Top Layer w0.2: U12.8 49.91,56.34 36.7,69.55 U13.2
TX2: length 13
  Top Layer w0.2: U12.5 53.09,51.06 53.09,60.53 53.52,60.97 U8.9
VDRV: length 18.4
  Top Layer w0.2: U4.28 79.9,46.54 ; 79.9,46.54 v2(80.01,46.44) ; 79.9,46.54 82.41,46.54 83.06,47.2 84.88,47.2 84.89,47.19 ; v2(71.63,52.53) R31.2
  Bottom Layer w0.2: v2(71.63,52.53) 73.02,52.53 75.44,50.12 76.33,50.12 v2(80.01,46.44)
VOUT: length 15.2
  Top Layer w0.5: U14.4 73.09,6.84 75.78,4.14
  vias: v2(88.9,16.91) v2(88.9,15.91) v2(88.9,14.91) v2(89.9,16.91) v2(89.9,15.91) v2(89.9,14.91) v2(90.9,16.91) v2(90.9,15.91) v2(90.9,14.91)
VSYS: length 23
  Top Layer w0.2: 91.31,34.5 85.85,34.5 84.84,35.51 83.44,35.51 78.74,40.21 78.74,41.99 77.11,43.62 U4.22 ; R45.2 85.85,22.43
  vias: v2(92.35,36.77) v2(92.35,36.07) v2(92.35,35.37) v2(93.05,36.77) v2(93.05,36.07) v2(93.05,35.37) v2(93.75,36.77) v2(93.75,36.07) v2(93.75,35.37)
VUP: length 16.2
  Top Layer w0.254: U1.16 10.25,75.61 11.05,76.41 18.36,76.41 C2.1 ; C2.1 21.26,74.85 R7.1 ; C2.1 19.13,74.85 U1.28
$1N1967: length 9.9
  Top Layer w0.254: U1.21 13.5,72.38 9.24,68.12 R17.1 10.69,66.35 C9.1
$1N1968: length 9.2
  Top Layer w0.254: U1.23 14.8,71.01 12.44,68.65 R10.1 12.59,67.8 C4.1
$1N1969: length 8.4
  Top Layer w0.254: C3.1 17.07,66.35 R6.1 15.63,69.68 16.1,70.15 U1.25
$1N1970: length 8.8
  Top Layer w0.254: U1.27 17.4,71.07 18.8,69.68 18.8,67.82 R1.1 20.27,66.35 C1.1
$1N1971: length 11.7
  Top Layer w0.254: U1.20 12.85,72.75 8.26,68.15 8.26,65.36 R20.1
$1N1972: length 10.7
  Top Layer w0.254: R16.1 11.68,65.12 11.68,69.17 14.15,71.63 U1.22
$1N1973: length 10
  Top Layer w0.254: U1.24 15.45,70.52 14.86,69.93 14.86,65.14 R9.1
$1N1974: length 10.3
  Top Layer w0.254: U1.26 16.75,70.58 18.03,69.3 18.03,65.16 R3.1
$1N1975: length 4.3
  Top Layer w0.254: R5.1 19.91,80.38 19.4,80.89 17.75,80.89 17.4,80.53 U1.2
$1N1976: length 7.3
  Top Layer w0.254: U1.3 16.75,80.64 17.75,81.65 20.55,81.65 21.31,80.89 R4.1
$1N1979: length 5.4
  Top Layer w0.254: R15.2 8.99,83.04 10.9,81.14 U1.12
$1N1980: length 5.3
  Top Layer w0.254: R14.2 10.39,82.79 12.2,80.98 U1.10
$1N1981: length 5.1
  Top Layer w0.254: R13.2 11.66,82.79 12.85,81.6 U1.9
$1N1982: length 23.5
  Top Layer w0.2: v2(25.78,91.9) 18.42,91.9 13.84,87.33 13.84,84.99 R12.2
  Top Layer w0.254: R12.2 12.93,82.79 13.5,82.22 U1.8
  Bottom Layer w0.2: v2(25.78,91.9) NOREF#3.1
$1N1983: length 4.8
  Top Layer w0.254: U1.7 14.28,79.63 14.28,81.92 14.7,82.34 C8.1
$1N1984: length 5.2
  Top Layer w0.254: U1.6 14.8,81.62 16.23,83.04 C7.1
$1N1985: length 5.5
  Top Layer w0.254: U1.5 15.45,81.25 17.63,83.43 C6.1
$1N1986: length 5.8
  Top Layer w0.254: U1.4 16.1,80.88 19.02,83.81 C5.1
$1N1987:
  vias: v1(4.19,72.98) v1(4.19,72.09) v1(4.19,69.8) v1(4.19,68.79) v1(5.36,72.98) v1(5.37,72.09) v1(5.36,69.8) v1(5.37,68.79)
$1N1992: length 17.4
  Top Layer w0.254: 7.11,68.63 R19.2 ; 7.11,68.63 Q4.4 ; 7.11,68.63 8.23,69.74 8.23,74.79 11.55,78.11 U1.11
$1N1993: length 14.8
  Top Layer w0.254: R15.1 6.19,85.58 3.78,83.17 3.78,74.59 Q5.4
$1N1994: length 6
  Top Layer w0.5: R18.1 10.84,58.21 Q6.3
$1N1995: length 7.7
  Top Layer w0.254: Q6.1 9.24,55.56 R20.2
$1N1996: length 6
  Top Layer w0.5: R11.1 14.03,58.1 Q3.3
$1N1997: length 7.7
  Top Layer w0.254: R16.2 12.44,55.45 Q3.1
$1N1998: length 5.9
  Top Layer w0.5: R8.1 17.23,57.99 Q2.3
$1N1999: length 7.7
  Top Layer w0.254: R9.2 15.53,62.76 Q2.1
$1N2000: length 5.9
  Top Layer w0.5: Q1.3 20.42,57.88 R2.1
$1N2001: length 7.6
  Top Layer w0.254: Q1.1 18.83,62.85 R3.2
$2N9896: length 46.8
  Top Layer w0.2: U4.1 80.64,51.53 80.64,59.77 81.71,60.83 R23.2 93.09,61.67 92.71,62.06 79.63,62.06 77.47,59.9 77.47,58.42 C16.2 77.47,57.42 77.47,56.71 R26.2
  vias: v2(92.48,58.55) v2(92.48,57.85) v2(92.48,57.15) v2(93.18,58.55) v2(93.18,57.85) v2(93.18,57.15) v2(93.88,58.55) v2(93.88,57.85) v2(93.88,57.15)
$2N9898: length 7.5
  Top Layer w0.2: U4.3 77.11,50.14 77.09,50.16 77.09,54.32 R25.1 76.65,54.75 75.31,54.75
$2N9899: length 7.5
  Top Layer w0.2: U4.2 77.51,50.14 77.47,50.18 77.47,54.19 R26.1 79.32,54.7 79.38,54.75
$2N9906: length 15.8
  Top Layer w0.2: Q7.4 84.46,34.88 83.06,34.88 78.11,39.83 78.11,41.86 76.71,43.26 U4.21
$2N9908: length 9.6
  Top Layer w0.2: R24.1 76.83,31.58 76.33,32.08 76.33,36.84 C22.1 76.33,37.99 76.33,39.08 R27.2
  vias: v2(81.32,32.58) v2(81.32,31.58) v2(81.32,30.58) v2(82.32,32.58) v2(82.32,31.58) v2(82.32,30.58) v2(83.32,32.58) v2(83.32,31.58) v2(83.32,30.58)
$2N10694: length 3.8
  Top Layer w0.2: U4.20 76.31,42.9 76.83,42.37 R27.1
$2N10699: length 3.8
  Top Layer w0.2: R28.1 75.44,43.26 75.91,43.73 U4.19
$2N11055: length 8.6
  Top Layer w0.2: U4.17 72.02,41.61 R36.2 70.1,41.54 C35.2
$2N11060: length 1.6
  Top Layer w0.2: C37.2 R36.1
$2N11209: length 6.8
  Top Layer w0.2: C34.2 70.09,44.91 74.02,44.91 U4.16
$2N11213: length 1.6
  Top Layer w0.2: C36.2 R35.1
$2N11400: length 7.1
  Top Layer w0.2: R34.1 R37.2 73.79,42.5 75.51,44.22 U4.18
$2N11711: length 9.4
  Top Layer w0.2: U4.8 74.92,48.98 71.44,48.98 C32.2 68.7,51.82 R32.2
$2N11917: length 6.6
  Top Layer w0.2: U4.9 74.11,48.14 73.91,48.34 70.42,48.34 C33.2
$2N12015: length 6.1
  Top Layer w0.2: R33.2 69.55,47.74 U4.10
$2N12389: length 2.1
  Top Layer w0.2: R39.2 85.73,81.87 86.88,83.02 U6.9
$2N12394: length 1.7
  Top Layer w0.2: U6.8 85.72,83.52 R38.2
$2N18353: length 2.3
  Top Layer w0.2: Q8.2 95.27,55.8 R58.2
$2N18407: length 1.9
  Top Layer w0.2: R59.2 84.96,53.84 Q10.2
$2N18436: length 6.9
  Top Layer w0.2: R60.1 v2(87.12,40.47) ; Q9.2 v2(91.31,38.12)
  Bottom Layer w0.2: v2(87.12,40.47) 88.97,40.47 v2(91.31,38.12)
$2N18466: length 3.1
  Top Layer w0.2: Q11.2 84.09,36.13 83.57,36.66 R61.1
$3N1326: length 2.4
  Top Layer w0.2: U11.A5 26.06,8.32 R53.1
$3N1328: length 2.1
  Top Layer w0.2: U11.B5 29.05,8.82 R50.1
$3N1407: length 48.2
  Top Layer w0.2: R51.2 27.05,11.37 27.05,22.43 48.26,43.64 48.26,49.53 U12.1
$3N1410: length 4.9
  Top Layer w0.2: R51.1 27.06,8.85 U11.A6 27.06,6.68 27.31,6.43 27.81,6.43 28.05,6.67 U11.B6
$3N1437: length 48.1
  Top Layer w0.2: U12.2 48.64,49.61 48.64,43.39 27.56,22.31 27.56,11.37 R52.2
$3N1440: length 4.2
  Top Layer w0.2: U11.B7 v2(26.56,8.46) ; U11.A7 27.56,8.85 R52.1
  Bottom Layer w0.2: v2(26.56,8.46) v2(27.56,8.46)
$3N1667: length 7.3
  Top Layer w0.2: v2(48.13,54.31) 47.91,54.53 U12.10 46.23,53.5 C48.2 ; U12.7 50.91,54.55 v2(50.67,54.31)
  Bottom Layer w0.2: v2(50.67,54.31) 50.29,53.93 48.51,53.93 v2(48.13,54.31)
$3N4191: length 1.8
  Top Layer w0.3: C39.2 73.95,18.64 U9.1
$3N4511: length 6.3
  Top Layer w0.2: C40.1 74.29,14.99 R44.1 R47.2 77.09,17.09 U9.3
$3N6002: length 5.5
  Top Layer w0.2: Q12.4 86.27,18 R45.1 86.33,17.52 Q13.3
$3N6004: length 1.8
  Top Layer w0.2: R46.2 83.66,16.07 Q13.1
$3N9179: length 3.3
  Top Layer w0.2: LED1.1 38.74,1.74 R54.1
$3N9201: length 3.3
  Top Layer w0.2: 43.3,1.48 43.57,1.74 R55.1

## Copper pours and planes (outline as drawn; the poured copper is in the pictures)
3.3V on Top Layer: 68.13,19.49 72.39,19.49 72.39,17.99 68.13,17.99
AGND on Top Layer: 45.21,70.31 42.93,68.03 42.93,64.22 46.99,60.15 46.99,51.13 57.4,40.72 57.4,35.77 60.15,35.77 60.15,40.39 67.55,47.78 70.36,47.78 73.15,50.57 73.15,66.63 69.47,70.31
AGND on Bottom Layer: 45.25,70.31 42.97,68.03 42.97,64.22 47.03,60.15 47.03,51.13 57.45,40.72 57.45,35.77 60.2,35.77 60.2,40.39 67.59,47.78 70.4,47.78 73.19,50.57 73.19,66.63 69.51,70.31
GND on Top Layer: -4.44,100.28 106.43,100.28 106.43,-6.78 -4.44,-6.78
GND on Top Layer: 3.02,67.73 6.1,67.73 6.1,63.45 3.02,63.45
GND on Bottom Layer: -2.92,97.62 104.27,97.62 104.27,-3.48 -2.92,-3.48
VBUS on Top Layer: 87.76,79.45 87.76,72.34 91.06,69.04 91.06,64.48 92.27,63.26 94.17,63.26 95.25,64.34 95.25,71.84 90.68,76.41 90.68,79.45
VBUS on Top Layer: 93.6,81.23 92.05,81.23 90.69,82.59 89.88,82.59 88.77,81.49 88.77,80.41 87.76,79.39 87.76,78.44 90.68,78.44 90.8,78.57 90.8,80.22 91.06,80.47 93.47,80.47 93.6,80.6
VBUS on Bottom Layer: 93.6,86.06 89.28,86.06 87.69,84.47 87.69,78.26 90.75,78.26 90.8,78.31 90.8,84.41 91.06,84.66 93.47,84.66 93.6,84.53
VIN on Top Layer: 4.19,76.79 5.97,76.79 5.97,74.14 4.19,74.14
B- on Top Layer: 11.43,89.36 19.3,89.36 19.3,85.17 11.43,85.17
B- on Top Layer: 5.08,84.15 4.01,83.09 4.01,78.88 4.25,78.64 6.13,78.64 8.33,80.83 8.33,83.44 7.61,84.15
B- on Bottom Layer: 10.8,96.09 10.8,90.12 3.3,82.63 3.3,75.39 4.19,74.5 6.48,74.5 7.97,73.01 7.97,67.84 20.53,67.84 21.04,68.35 21.04,96.09
BAT4 on Top Layer: 75.06,32.85 75.06,30.69 76.13,29.62 76.13,24.77 76.07,24.72 72.14,24.72 72.14,31.32 73.66,32.85
BAT4 on Bottom Layer: 72.26,26.62 85.35,26.62 88.38,23.59 88.38,1.22 80.39,1.22 80.26,1.35 80.26,19.77 77.47,22.56 72.52,22.56 72.26,22.81
SW1 on Top Layer: 90.15,57.61 91.53,56.23 93.58,56.23 93.73,56.09 93.73,54.56 95.12,53.17 95.12,49.61 94.87,49.36 91.19,49.36 86.74,53.8 86.74,57.23 87.12,57.61
SW2 on Top Layer: 91.44,43.89 86.8,39.25 86.8,35.46 89.45,35.46 91.78,37.79 94.73,37.79 95,38.05 95,43.64 94.74,43.89
VOUT on Top Layer: 87.38,17.99 87.38,13.54 80.64,6.81 74.68,6.81 73.53,5.67 73.53,2.37 74.8,1.1 82.68,1.1 92.08,10.49 92.08,17.22 91.31,17.99
VSYS on Top Layer: 85.22,32.72 85.22,28.53 78.49,21.8 75.82,21.8 75.82,20.16 75.96,20.01 84.83,20.01 85.6,20.78 87.25,20.78 87.63,21.16 87.63,31.96 86.87,32.72
VSYS on Top Layer: 91.82,37.29 90.55,36.02 90.55,30.05 87.63,27.13 87.63,21.16 88.65,20.15 88.65,19 89.03,18.62 92.08,18.62 92.46,19 92.46,25.61 95.25,28.4 95.25,36.53 94.49,37.29
$1N1987 on Top Layer: 3.43,73.74 6.1,73.74 6.1,68.15 3.43,68.15
$2N9896 on Top Layer: 91.44,61.42 95,61.42 95,56.59 91.44,56.59
$2N9908 on Top Layer: 77.02,32.66 78.55,34.18 84.01,34.18 84.33,33.86 84.33,29.37 83.94,28.98 78.79,28.98 77.02,30.75
$3N4166 on Top Layer: 70.1,21.8 75.52,21.8 75.52,19.77 70.1,19.77

## Text on the board
Top Solder Mask Layer: 四串锂电池电源V1 | 2025年4月27日 | KEVIN
